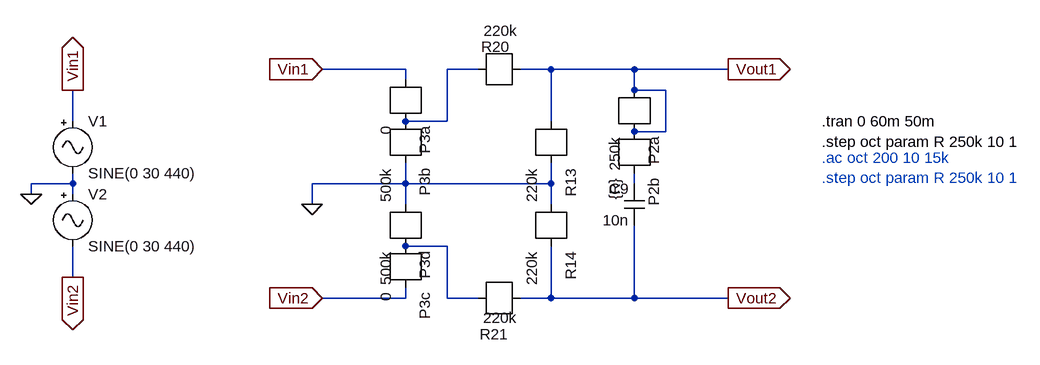
[diagram p0: schematic master-cut.asc]
master-cut.asc, the LTspice schematic file:
Version 4
SHEET 1 1100 680
WIRE 80 112 -48 112
WIRE 192 112 144 112
WIRE 304 112 256 112
WIRE 432 112 304 112
WIRE 576 112 432 112
WIRE 80 128 80 112
WIRE 432 144 432 112
WIRE 480 144 432 144
WIRE -432 192 -432 144
WIRE 144 192 144 112
WIRE 144 192 80 192
WIRE 304 192 304 112
WIRE 480 208 480 144
WIRE 480 208 432 208
WIRE -432 288 -432 272
WIRE -432 288 -496 288
WIRE 80 288 80 256
WIRE 80 288 -64 288
WIRE 304 288 304 256
WIRE 304 288 80 288
WIRE 432 288 432 272
WIRE -496 304 -496 288
WIRE -432 304 -432 288
WIRE -64 320 -64 288
WIRE 80 320 80 288
WIRE 304 320 304 288
WIRE 144 384 80 384
WIRE -432 432 -432 384
WIRE 80 464 80 448
WIRE 80 464 -48 464
WIRE 144 464 144 384
WIRE 192 464 144 464
WIRE 304 464 304 384
WIRE 304 464 256 464
WIRE 432 464 432 352
WIRE 432 464 304 464
WIRE 576 464 432 464
FLAG -48 112 Vin1
IOPIN -48 112 In
FLAG -48 464 Vin2
IOPIN -48 464 In
FLAG -64 320 0
FLAG 576 112 Vout1
IOPIN 576 112 Out
FLAG 576 464 Vout2
IOPIN 576 464 Out
FLAG -496 304 0
FLAG -432 144 Vin1
IOPIN -432 144 Out
FLAG -432 432 Vin2
IOPIN -432 432 Out
SYMBOL cap 448 352 R180
WINDOW 0 24 56 Left 2
WINDOW 3 24 8 Left 2
SYMATTR InstName C9
SYMATTR Value 10n
SYMBOL r 80 320 R90
SYMATTR InstName P3d
SYMATTR Value 500k
SYMBOL r 80 384 R90
SYMATTR InstName P3c
SYMATTR Value 0
SYMBOL r 80 128 R90
SYMATTR InstName P3a
SYMATTR Value 0
SYMBOL r 80 192 R90
SYMATTR InstName P3b
SYMATTR Value 500k
SYMBOL r 192 464 R0
WINDOW 0 46 56 Right 2
WINDOW 3 60 30 Right 2
SYMATTR InstName R21
SYMATTR Value 220k
SYMBOL r 192 112 R0
WINDOW 0 49 -35 Right 2
WINDOW 3 61 -59 Right 2
SYMATTR InstName R20
SYMATTR Value 220k
SYMBOL r 304 192 R90
SYMATTR InstName R13
SYMATTR Value 220k
SYMBOL r 304 320 R90
SYMATTR InstName R14
SYMATTR Value 220k
SYMBOL r 432 144 R90
SYMATTR InstName P2a
SYMATTR Value 250k
SYMBOL r 432 208 R90
SYMATTR InstName P2b
SYMATTR Value {R}
SYMBOL signal -432 176 R0
SYMATTR InstName V1
SYMATTR Value SINE(0 30 440)
SYMATTR Value2 AC 30
SYMBOL signal -432 288 R0
SYMATTR InstName V2
SYMATTR Value SINE(0 30 440)
SYMATTR Value2 AC 30
TEXT 720 192 Left 2 !.tran 0 60m 50m\n.step oct param R 250k 10 1
TEXT 720 248 Left 2 ;.ac oct 200 10 15k\n.step oct param R 250k 10 1

The netlist it stands for:
* master-cut.asc
C9 Vout2 N002 10n
R§P3d N003 0 500k
R§P3c Vin2 N003 0
R§P3a N001 Vin1 0
R§P3b 0 N001 500k
R21 Vout2 N003 220k
R20 Vout1 N001 220k
R13 0 Vout1 220k
R14 Vout2 0 220k
R§P2a Vout1 Vout1 250k
R§P2b N002 Vout1 {R}
V1 Vin1 0 SINE(0 30 440) AC 30
V2 0 Vin2 SINE(0 30 440) AC 30
.tran 0 60m 50m
.step oct param R 250k 10 1
* .ac oct 200 10 15k
* .step oct param R 250k 10 1
.backanno
.end